# Altium schematic sheet DPPXHK_10CL010_DEBUGPORT.SchDoc
size A4
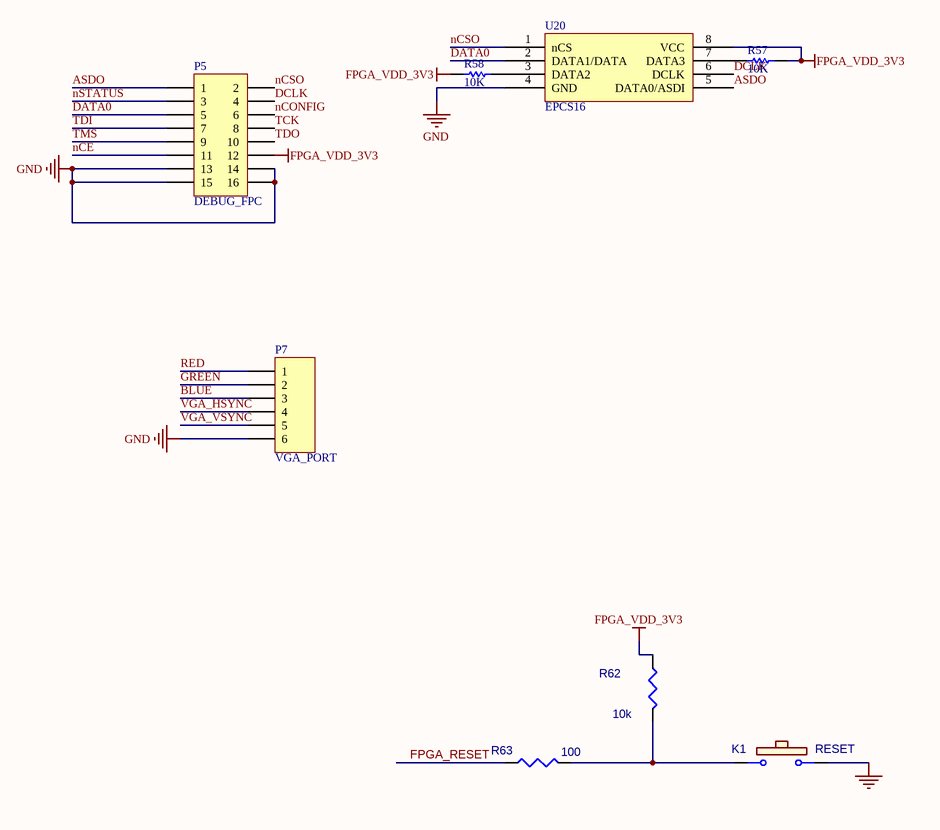
[diagram p0: DPPXHK_10CL010_DEBUGPORT.SchDoc]

## Parts
K1  RESET  [BUTTON-3*6]
P5  DEBUG_FPC  [FPC-0.5-16]
P7  VGA_PORT  [FPC-0.5-6]
R57  10K  [0402R]
R58  10K  [0402R]
R62  10k  [0402R]
R63  100  [0402R]
U20  EPCS16  [SO-g8]

## Nets
FPGA_VDD_3V3: P5.12 R57.2 R58.1 R62.1 U20.8(VCC)
GND: K1.2 P5.13 P5.14 P5.15 P5.16 P7.6 U20.4(GND)
ASDO: P5.1 U20.5(DATA0/ASDI)
BLUE: P7.3
DATA0: P5.5 U20.2(DATA1/DATA)
DCLK: P5.4 U20.6(DCLK)
FPGA_RESET: R63.1
GREEN: P7.2
nCE: P5.11
nCONFIG: P5.6
nCSO: P5.2 U20.1(nCS)
nSTATUS: P5.3
RED: P7.1
TCK: P5.8
TDI: P5.7
TDO: P5.10
TMS: P5.9
VGA_HSYNC: P7.4
VGA_VSYNC: P7.5
NetK1_1: K1.1 R62.2 R63.2
NetR57_1: R57.1 U20.7(DATA3)
NetR58_2: R58.2 U20.3(DATA2)

## Library data of the parts
K1 = KEYB
P5 = Header 8X2: Header, 8-Pin, Dual row; LatestRevisionDate: 17-Jul-2002; LatestRevisionNote: Re-released for DXP Platform.; Publisher: Altium Limited
P7 = Header 6: Header, 6-Pin; LatestRevisionDate: 17-Jul-2002; LatestRevisionNote: Re-released for DXP Platform.; Publisher: Altium Limited
R57 R58 = Res1: Resistor; Manufacturer: Generic Components; Class: Passive; Published: 08/06/2000; Publisher: Altium Hobart Technology Centre; SubClass: Resistor; Value: 10K
R62 R63 = R_Dup2